# Altium schematic sheet STM8S103_FM1702.SchDoc
size A4; Organization: Altium Limited; Address1: L3, 12a Rodborough Rd; Address2: Frenchs Forest; Address3: NSW; Address4: Australia 2086
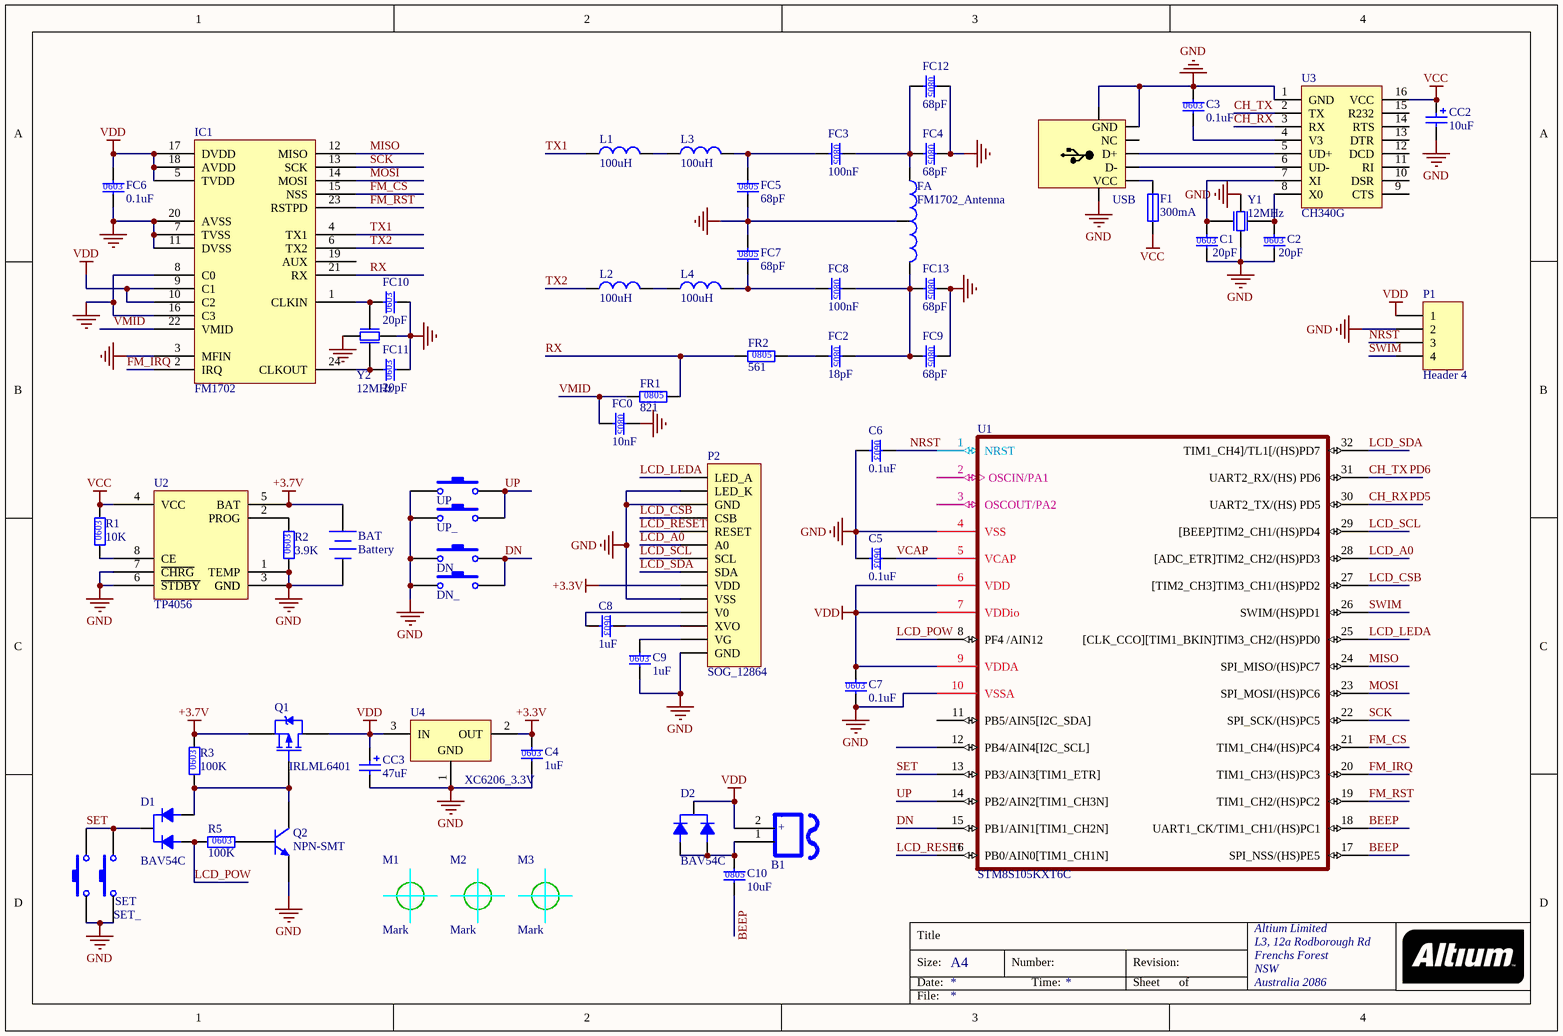
[diagram p0: STM8S103_FM1702.SchDoc]

## Parts
B1  BUZZER  [BUZZ_9025]  (value not drawn)
BAT  Battery  [HX1.25-2]
C1  value 20pF  [C0603]  (hidden comment: C0603)
C2  value 20pF  [C0603]  (hidden comment: C0603)
C3  value 0.1uF  [C0603]  (hidden comment: C0603)
C4  value 1uF  [C0603]  (hidden comment: C0603)
C5  value 0.1uF  [C0603]  (hidden comment: C0603)
C6  value 0.1uF  [C0603]  (hidden comment: C0603)
C7  value 0.1uF  [C0603]  (hidden comment: C0603)
C8  value 1uF  [C0603]  (hidden comment: C0603)
C9  value 1uF  [C0603]  (hidden comment: C0603)
C10  value 10uF  [C0805]  (hidden comment: C0805)
CC2  Capacitance: 10uF  [TAN-B-3528]  (hidden comment: Cap Tan B)
CC3  Capacitance: 47uF  [TAN-C-6032]  (hidden comment: Cap Tan C)
D1  BAS40_5  [SOT-23]  (value not drawn)
D2  BAS40_5  [SOT-23]  (value not drawn)
DN  Button  [BUTTON_SMD]  (value not drawn)
DN_  Button  [SWITCH_SMD]  (value not drawn)
F1  300mA  [F1206]
FA  FM1702_Antenna  [FM1702_Antenna]
FC0  value 10nF  [C0805]  (hidden comment: C0805)
FC2  value 18pF  [C0805]  (hidden comment: C0805)
FC3  value 100nF  [C0805]  (hidden comment: C0805)
FC4  value 68pF  [C0805]  (hidden comment: C0805)
FC5  value 68pF  [C0805]  (hidden comment: C0805)
FC6  value 0.1uF  [C0603]  (hidden comment: C0603)
FC7  value 68pF  [C0805]  (hidden comment: C0805)
FC8  value 100nF  [C0805]  (hidden comment: C0805)
FC9  value 68pF  [C0805]  (hidden comment: C0805)
FC10  value 20pF  [C0603]  (hidden comment: C0603)
FC11  value 20pF  [C0603]  (hidden comment: C0603)
FC12  value 68pF  [C0805]  (hidden comment: C0805)
FC13  value 68pF  [C0805]  (hidden comment: C0805)
FR1  ?  [R0805]  (value not drawn)
FR2  ?  [R0805]  (value not drawn)
IC1  FM1702  [SOP-24L]
L1  value 100uH  [L2013-0805]  (hidden comment: Inductor Chip)
L2  value 100uH  [L2013-0805]  (hidden comment: Inductor Chip)
L3  value 100uH  [L2013-0805]  (hidden comment: Inductor Chip)
L4  value 100uH  [L2013-0805]  (hidden comment: Inductor Chip)
M1  Mark  [MARK]
M2  Mark  [MARK]
M3  Mark  [MARK]
P1  Header 4  [HDR1X4]
P2  SOG_12864  [SOG12864]
Q1  IRLML6401  [SOT-23]
Q2  NPN-SMT  [SO-G3/C2.5]
R1  ?  [R0603]  (value not drawn)
R2  ?  [R0603]  (value not drawn)
R3  ?  [R0603]  (value not drawn)
R5  ?  [R0603]  (value not drawn)
SET  Button  [BUTTON_SMD]  (value not drawn)
SET_  Button  [SWITCH_SMD]  (value not drawn)
U1  STM8S105KXT6C  [TQFP-32AN]
U2  TP4056  [SOP-8PAD]
U3  CH340G  [SOP-16L]
U4  XC6206_3.3V  [SOT-23]
UP  Button  [BUTTON_SMD]  (value not drawn)
UP_  Button  [SWITCH_SMD]  (value not drawn)
USB  USB  [USB-B_Micro]  (value not drawn)
Y1  Frequency: 12MHz  [X3225]  (hidden comment: CRYSTAL)
Y2  Frequency: 12MHz  [X3225]  (hidden comment: CRYSTAL)

## Nets
+3.3V: C4.1 P2.9(VDD) U4.2(OUT)
+3.7V: BAT.2(+) Q1.2(S) R3.2 U2.5(BAT)
GND: BAT.1(-) C1.2 C2.2 C3.1 C4.2 C5.2 C6.2 C7.2 C9.2 CC2.1 CC3.1 DN.1 DN_.1 FA.2 FC0.1 FC4.1 FC5.2 FC6.2 FC7.1 FC9.1 FC10.2 FC11.2 FC12.1 FC13.1 IC1.3(MFIN) IC1.7(TVSS) IC1.8(C0) IC1.11(DVSS) IC1.16(C3) IC1.20(AVSS) P1.2 P2.2(LED_K) P2.3(GND) P2.10(VSS) P2.14(GND) Q2.1(E) R2.1 SET.1 SET_.1 U1.4(VSS) U1.10(VSSA) U2.1(TEMP) U2.3(GND) U2.6(~{STDBY}) U2.7(~{CHRG}) U2.9(GND) U3.1(GND) U4.1(GND) UP.1 UP_.1 USB.5(GND) USB.6(GND) USB.7(GND) Y1.2(GND) Y1.4(GND) Y2.2(GND) Y2.4(GND)
VCC: CC2.2 F1.2 R1.2 U2.4(VCC) U3.16(VCC)
VDD: B1.2 C7.1 CC3.2 D2.3 FC6.1 IC1.5(TVDD) IC1.9(C1) IC1.10(C2) IC1.17(DVDD) IC1.18(AVDD) P1.1 Q1.3(D) U1.6(VDD) U1.7(VDDio) U1.9(VDDA) U4.3(IN)
BEEP: C10.2 U1.17(SPI_NSS/(HS)PE5) U1.18(UART1_CK/TIM1_CH1/(HS)PC1)
CH_RX: U1.30(UART2_TX/(HS)_PD5) U3.3(RX)  [also labelled PD5]
CH_TX: U1.31(UART2_RX/(HS)_PD6) U3.2(TX)  [also labelled PD6]
DN: DN.2 DN_.2 U1.15(PB1/AIN1[TIM1_CH2N])
FM_CS: IC1.15(NSS) U1.21(TIM1_CH4/(HS)PC4)
FM_IRQ: IC1.2(IRQ) U1.20(TIM1_CH3/(HS)PC3)
FM_RST: IC1.23(RSTPD) U1.19(TIM1_CH2/(HS)PC2)
LCD_A0: P2.6(A0) U1.28([ADC_ETR]TIM2_CH2/(HS)PD3)
LCD_CSB: P2.4(CSB) U1.27([TIM2_CH3]TIM3_CH1/(HS)PD2)
LCD_LEDA: P2.1(LED_A) U1.25([CLK_CCO][TIM1_BKIN]TIM3_CH2/(HS)PD0)
LCD_POW: D1.1 R5.1 U1.8(PF4_/AIN12)
LCD_RESET: P2.5(RESET) U1.16(PB0/AIN0[TIM1_CH1N])
LCD_SCL: P2.7(SCL) U1.29([BEEP]TIM2_CH1/(HS)PD4)
LCD_SDA: P2.8(SDA) U1.32(TIM1_CH4]/TL1[/(HS)PD7)
MISO: IC1.12(MISO) U1.24(SPI_MISO/(HS)PC7)
MOSI: IC1.14(MOSI) U1.23(SPI_MOSI/(HS)PC6)
NRST: C6.1 P1.3 U1.1(NRST)
RX: FR1.2 FR2.1 IC1.21(RX)
SCK: IC1.13(SCK) U1.22(SPI_SCK/(HS)PC5)
SET: D1.3 SET.2 SET_.2 U1.13(PB3/AIN3[TIM1_ETR])
SWIM: P1.4 U1.26(SWIM/(HS)PD1)
TX1: IC1.4(TX1) L1.1
TX2: IC1.6(TX2) L2.1
UP: U1.14(PB2/AIN2[TIM1_CH3N]) UP.2 UP_.2
VCAP: C5.1 U1.5(VCAP)
VMID: FC0.2 FR1.1 IC1.22(VMID)
NetB1_1: B1.1 C10.1 D2.1 D2.2
NetC1_1: C1.1 U3.7(XI) Y1.3(OSC2)
NetC2_1: C2.1 U3.8(X0) Y1.1(OSC1)
NetC3_2: C3.2 U3.4(V3)
NetC8_1: C8.1 P2.12(XVO)
NetC8_2: C8.2 P2.11(V0)
NetC9_1: C9.1 P2.13(VG)
NetD1_2: D1.2 Q1.1(G) Q2.3(C) R3.1
NetF1_1: F1.1 USB.1(VCC)
NetFA_1: FA.1 FC3.1 FC4.2 FC12.2
NetFA_3: FA.3 FC2.1 FC8.1 FC9.2 FC13.2
NetFC2_2: FC2.2 FR2.2
NetFC3_2: FC3.2 FC5.1 L3.2
NetFC7_2: FC7.2 FC8.2 L4.2
NetFC10_1: FC10.1 IC1.1(CLKIN) Y2.1(OSC1)
NetFC11_1: FC11.1 IC1.24(CLKOUT) Y2.3(OSC2)
NetL1_2: L1.2 L3.1
NetL2_2: L2.2 L4.1
NetQ2_2: Q2.2(B) R5.2
NetR1_1: R1.1 U2.8(CE)
NetR2_2: R2.2 U2.2(PROG)
NetU3_5: U3.5(UD+) USB.3(D+)
NetU3_6: U3.6(UD-) USB.2(D-)

Not connected (* = marked no-connect by the designer): IC1 19(AUX); U1 2(OSCIN/PA1) 3(OSCOUT/PA2) 11(PB5/AIN5[I2C_SDA]) 12(PB4/AIN4[I2C_SCL]); U3 9(CTS) 10(DSR) 11(RI) 12(DCD) 13(DTR) 14(RTS) 15(R232); USB 4(NC)

## Notes on the sheet
- Title
- Size:
- Date:
- A4
- Number:
- Time:
- Revision:
- Sheet
- of
- File:
- (in symbol BAS40_5) BAV54C
- (in symbol BUZZER) +
- (in symbol C0603) 0603
- (in symbol C0805) 0805
- (in symbol R0603) 0603; 10K; 3.9K; 100K
- (in symbol R0805) 0805; 821; 561

## Library data of the parts
BAT = Battery-N: Multicell Battery; pin to pad: 1>2 2>1; Published: 24-Mar-1999; Revision: July-2002: Re-released for DXP Platform.; Publisher: Altium Limited
C1-C9 FC6 FC10 FC11 = C0603: Polarized Capacitor (Radial); Published: 8-Jun-2000; Revision: July-2002: Re-released for DXP Platform.; Publisher: Altium Limited
C10 FC0 FC2-FC5 FC7-FC9 FC12 FC13 = C0805: Polarized Capacitor (Radial); Published: 8-Jun-2000; Revision: July-2002: Re-released for DXP Platform.; Publisher: Altium Limited
CC2 = Cap Tan B: Polarized Capacitor (Radial); Voltage: 16V; Published: 8-Jun-2000; Revision: July-2002: Re-released for DXP Platform.; Publisher: Altium Limited
CC3 = Cap Tan C: Polarized Capacitor (Radial); Voltage: 10V; Published: 8-Jun-2000; Revision: July-2002: Re-released for DXP Platform.; Publisher: Altium Limited
D1 D2 = BAS40_5: Default Diode; Code - JEDEC: DO-214-AB; Published: 8-Jun-2000; Revision: July-2002: Re-released for DXP Platform.; Publisher: Altium Limited
F1 = Fuse: Published: 8-Jun-2000; Revision: July-2002: Re-released for DXP Platform.; Publisher: Altium Limited
FR1 FR2 = R0805
L1-L4 = Inductor Chip: Inductor; Published: 8-Jun-2000; Revision: July-2002: Re-released for DXP Platform.; Publisher: Altium Limited
P1 = Header 4: Header, 4-Pin; LatestRevisionDate: 17-Jul-2002; LatestRevisionNote: Re-released for DXP Platform.; Publisher: Altium Limited
Q1 = IRLML6401: P-Channel Power MOSFET; Note: Pin 4 not drawn and electrically connected to Pin 2.; Code - JEDEC: TO-220-AB; Published: 8-Jun-2000; Revision: July-2002: Re-released for DXP Platform.; Datasheet: Latest Revision: PD-9.390D; Package Reference: TO-220AB; Publisher: Altium Limited
Q2 = NPN-SMT: NPN Bipolar Transistor; Code - JEDEC: TO-226-AA; Published: 8-Jun-2000; Revision: July-2002: Re-released for DXP Platform.; Publisher: Altium Limited
R1-R3 R5 = R0603
U1 = STM8S105K4T6C: ST 8-bit  Microcontroller
U4 = XC6206: POSITIVE OUTPUT VOLTAGE
Y1 Y2 = CRYSTAL: Crystal Oscillator; Published: 8-Jun-2000; Revision: July-2002: Re-released for DXP Platform.; Publisher: Altium Limited
DN DN_ SET SET_ UP UP_ = Button: Published: 24-Mar-1999; LatestRevisionDate: 17-Jul-2002; LatestRevisionNote: Re-released for DXP Platform.; PackageReference: SPST-2; Publisher: Altium Limited
M1-M3 = Mark: Published: 24-Mar-1999; Revision: July-2002: Re-released for DXP Platform.; Publisher: Altium Limited
P2 = SOG_12864: LatestRevisionDate: 17-Jul-2002; LatestRevisionNote: Re-released for DXP Platform.; Publisher: Altium Limited